# Altium schematic sheet IO Peripherals.SchDoc
size A4; DocumentNumber: 6; Revision: B.2(PCB.SCH); SheetNumber: 6; SheetTotal: 6
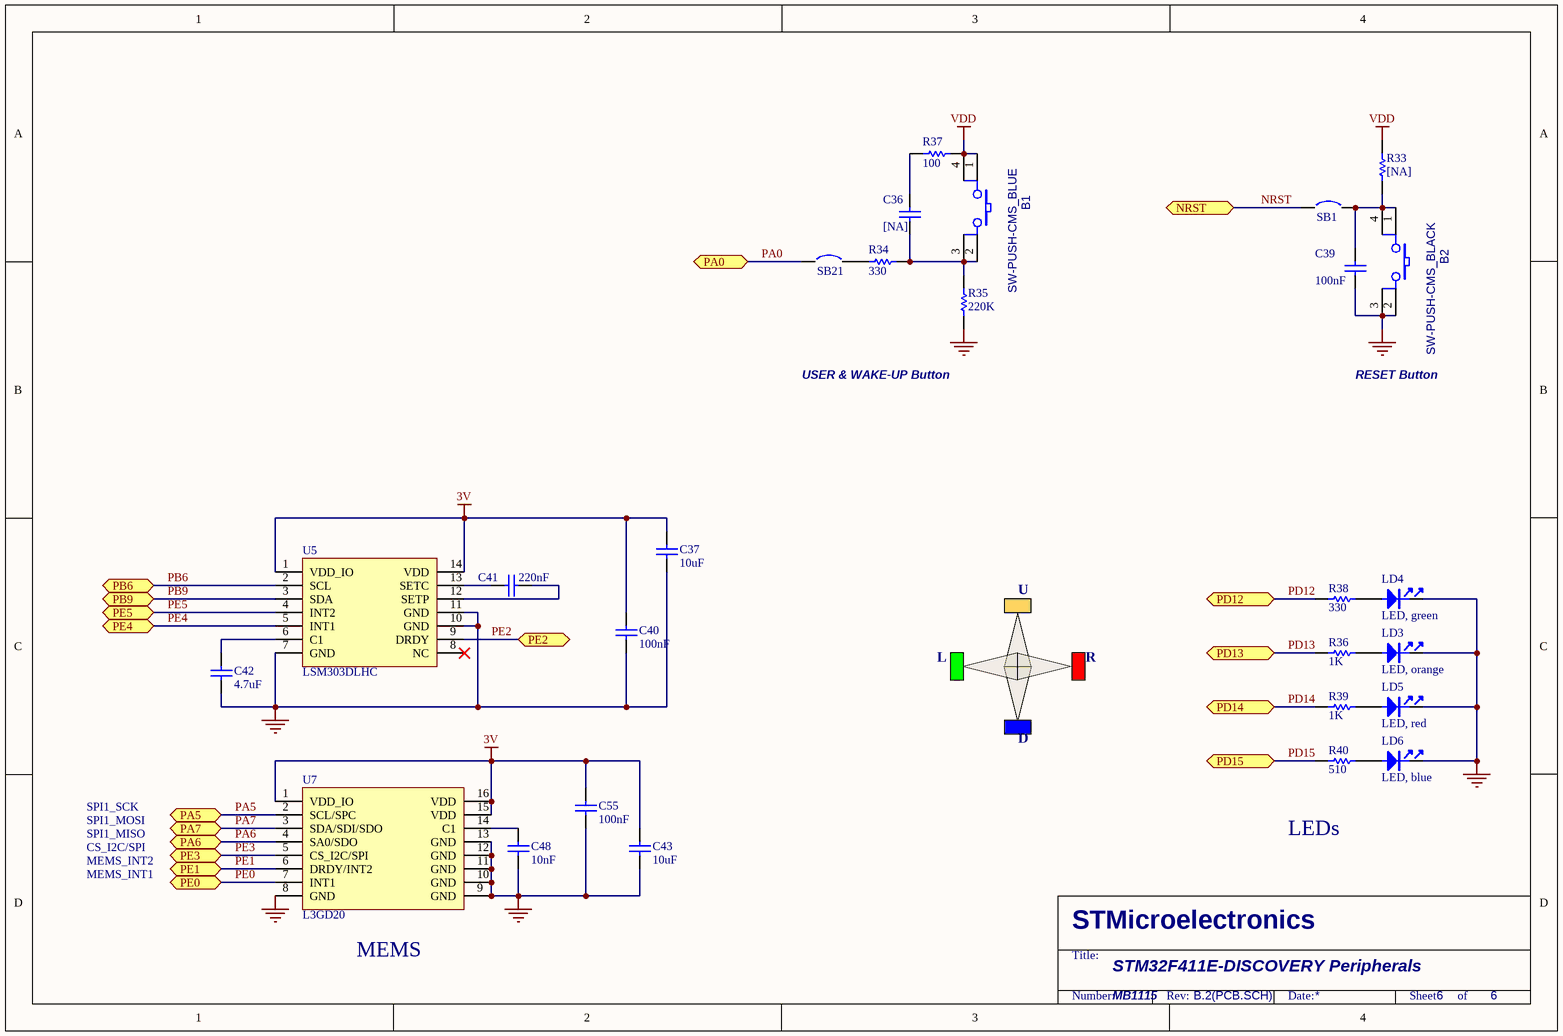
[diagram p0: IO Peripherals.SchDoc]

## Parts
B1  SW-PUSH-CMS_BLUE  [BP1CMS]
B2  SW-PUSH-CMS_BLACK  [BP1CMS]
C36  [NA]  [0402C]
C37  10uF  [0603C]
C39  100nF  [0402C]
C40  100nF  [0402C]
C41  220nF  [0603C]
C42  4.7uF  [0603C]
C43  10uF  [0603C]
C48  10nF  [0603C]
C55  100nF  [0402C]
LD3  LED, orange  [0603D]
LD4  LED, green  [0603D]
LD5  LED, red  [0603D]
LD6  LED, blue  [0603D]
R33  [NA]  [0402R]
R34  330  [0402R]
R35  220K  [0402R]
R36  1K  [0402R]
R37  100  [0402R]
R38  330  [0402R]
R39  1K  [0402R]
R40  510  [0402R]
SB1  Circuit Breaker  [JP2_SMD]  (value not drawn)
SB21  Circuit Breaker  [JP2_SMD]  (value not drawn)
U5  LSM303DLHC  [LGA14(3*5)]
U7  L3GD20  [LGA16-4x4]

## Ports
NRST, PA0, PA5, PA6, PA7, PB6, PB9, PD12, PD13, PD14, PD15, PE0, PE1, PE2, PE3, PE4, PE5

## Nets
3V: C37.2 C40.2 C43.2 C55.2 U5.1(VDD_IO) U5.14(VDD) U7.1(VDD_IO) U7.15(VDD) U7.16(VDD)
GND: B2.2 B2.3 C37.1 C39.1 C40.1 C42.1 C43.1 C48.1 C55.1 LD3.2 LD4.2 LD5.2 LD6.2 R35.1 U5.7(GND) U5.10(GND) U5.11(GND) U7.8(GND) U7.9(GND) U7.10(GND) U7.11(GND) U7.12(GND) U7.13(GND)
VDD: B1.1 B1.4 R33.2 R37.2
NRST: SB1.1 ; port NRST
PA0: SB21.1 ; port PA0
PA5: U7.2(SCL/SPC) ; port PA5
PA6: U7.4(SA0/SDO) ; port PA6
PA7: U7.3(SDA/SDI/SDO) ; port PA7
PB6: U5.2(SCL) ; port PB6
PB9: U5.3(SDA) ; port PB9
PD12: R38.2 ; port PD12
PD13: R36.2 ; port PD13
PD14: R39.2 ; port PD14
PD15: R40.2 ; port PD15
PE0: U7.7(INT1) ; port PE0
PE1: U7.6(DRDY/INT2) ; port PE1
PE2: U5.9(DRDY) ; port PE2
PE3: U7.5(CS_I2C/SPI) ; port PE3
PE4: U5.5(INT1) ; port PE4
PE5: U5.4(INT2) ; port PE5
NetB1_2: B1.2 B1.3 C36.1 R34.2 R35.2
NetB2_1: B2.1 B2.4 C39.2 R33.1 SB1.2
NetC36_2: C36.2 R37.1
NetC41_1: C41.1 U5.13(SETC)
NetC41_2: C41.2 U5.12(SETP)
NetC42_2: C42.2 U5.6(C1)
NetC48_2: C48.2 U7.14(C1)
NetLD3_1: LD3.1 R36.1
NetLD4_1: LD4.1 R38.1
NetLD5_1: LD5.1 R39.1
NetLD6_1: LD6.1 R40.1
NetR34_1: R34.1 SB21.2

Not connected (* = marked no-connect by the designer): U5 8(NC)*

## Notes on the sheet
- USER & WAKE-UP Button
- RESET Button
- U
- L
- R
- D
- SPI1_MOSI
- SPI1_SCK
- SPI1_MISO
- CS_I2C/SPI
- LEDs
- MEMS_INT1
- MEMS_INT2
- (near U7) MEMS
- STM32F411E-DISCOVERY Peripherals
- MB1115
- STMicroelectronics
- Title:
- Number:
- Rev:
- Date:
- Sheet       of

## Library data of the parts
B1 = SW-PUSH-CMS_BLUE: Non-Open Push-Button 0.1A 24V; Manuf_2: FARNELL; Manuf_Part_2: 535-930; Manuf_1: wealthmetal; Manuf_Part_1: TD0341X-G01-BLU; Ref St: 9180120; Description: Non-Open Push Button,Blue 0.1A 24V,Square head,6*6,SMT,180Degree,TD-0341X-GO1,wealthmetal; Distrib: *
B2 = SW-PUSH-CMS_BLACK: Non-Open Push-Button 0.1A 24V; Manuf_2: FARNELL; Manuf_Part_2: 535-930; Manuf_1: wealthmetal; Manuf_Part_1: TD0341X-G01-BLA; Ref St: 9180120; Description: Non-Open Push Button,Black 0.1A 24V,Square head,6*6,SMT,180Degree,TD-0341X-GO1,wealthmetal; Distrib: *
C36 = Cap_NA_0402: Capacitor,NA,0402; Fitted: NO; Revision: July-2002: Re-released for DXP Platform.; Value: [NA]
C37 C43 = Cap_10uF_X5R_10%_0603: Capacitor,10uF,6.3V,X5R,20%,0603,YAGEO; Manuf_Part_1: CC0603KRX5R5BB106; Revision: July-2002: Re-released for DXP Platform.; Value: 10uF; Order: CC0603KRX5R5BB106; Manuf_1: YAGEO
C39 C40 C55 = Cap_100nF_X7R_10%_0402: Capacitor,100nF,16V,X7R,10%,0402,YAGEO; Manuf_Part_1: CC0402KRX7R7BB104; Revision: July-2002: Re-released for DXP Platform.; Value: 100nF; Order: CC0402KRX7R7BB104; Manuf_1: YAGEO
C41 = Cap_220nF_X7R_10%_0603: Capacitor,220nF,16V,X7R,10%,0603,YAGEO; Manuf_Part_1: CC0603KRX7R7BB224; Revision: July-2002: Re-released for DXP Platform.; Value: 220nF; Order: CC0603KRX7R7BB224; Manuf_1: YAGEO
C42 = Cap_4.7uF_X5R_10%_0603: Capacitor,4.7uF,16V, X5R,10%,0603,YAGEO; Manuf_Part_1: CC0603KRX5R7BB475; Order: CC0603KRX5R7BB105; Revision: July-2002: Re-released for DXP Platform.; Value: 4.7uF; Manuf_1: YAGEO
C48 = Cap_10nF_X7R_10%_0603: Capacitor,10nF,50V,X7R,10%,0603,YAGEO; Manuf_Part_1: CC0603KRX7R9BB103; Revision: July-2002: Re-released for DXP Platform.; Value: 10nF; Order: CC0603KRX7R9BB103; Manuf_1: YAGEO
LD3 = LED_orange: LED, orange, 0603; Manuf_1: everlight; Manuf_Part_1: 19-217/S2C-AM2N2VY/3T; Description: LED,orange,0603,19-217/S2C-AM2N2VY/3T,everlight; Order: 19-217/S2C-AM2N2VY/3T
LD4 = LED_green: LED, green, 0603; Manuf_1: everlight; Manuf_Part_1: 19-213SYGC/S530-E2/TR8; Description: LED,green,0603,19-213SYGC/S530-E2/TR8,everlight; Order: 19-213SYGC/S530-E2/TR8
LD5 = LED_red: LED, red, 0603; Manuf_1: everlight; Manuf_Part_1: 19-213-R6C-AP1Q2B/3T; Description: LED,red,0603,19-213-R6C-AP1Q2B/3T,everlight; Order: 19-213-R6C-AP1Q2B/3T
LD6 = LED_blue: LED, blue, 0603; Manuf_1: everlight; Manuf_Part_1: 19-217/BHC-ZL1M2RY/3T; Description: LED,Blue,0603,19-217/BHC-ZL1M2RY/3T,everlight; Order: 19-217/BHC-ZL1M2RY/3T
R33 = Res_NA_0402: Resistor,[NA],0402; Fitted: NO; Value: [NA]
R34 = res1: Resistor; Published: 8-Jun-2000; Revision: July-2002: Re-released for DXP Platform.; Publisher: Altium Limited; Value: 330
R35 = res1: Resistor; Value: 10K; Published: 8-Jun-2000; Revision: July-2002: Re-released for DXP Platform.; Publisher: Altium Limited
R36 R39 = Res1: Resistor; Published: 8-Jun-2000; Revision: July-2002: Re-released for DXP Platform.; Publisher: Altium Limited; Value: 1K
R37 = res1: Resistor; Value: 330; Published: 8-Jun-2000; Revision: July-2002: Re-released for DXP Platform.; Publisher: Altium Limited
R38 R40 = Res1: Resistor; Value: 1K; Published: 8-Jun-2000; Revision: July-2002: Re-released for DXP Platform.; Publisher: Altium Limited
SB1 SB21 = Circuit Breaker: Solder: YES; Revision: July-2002: Re-released for DXP Platform.
U5 = LSM303DLHC: Ultra compact high performance e-compass 3D accelerometer and 3D magnetometer module; Manuf_1: STM; Manuf_Part_1: LSM303DLHCTR; Provided: ST; Ref St: 9177037; ECCN_US/EU: EAR99/NEC; Distrib: ST; Order: LSM303DLHCTR
U7 = L3GD20: MEMS motion sensor three-axis digital output gyroscopeelerometer; Manuf_1: STM; Manuf_Part_1: L3GD20TR; Provided: ST; Ref St: 9177042; ECCN_US/EU: EAR99/NEC; Distrib: ST; Footprint: LGA16(4*4); Order: L3GD20TR